# EAGLE design Debug-Edge_SWD-to-J-Link-Edu-Mini-adapter-with-USB-power (EAGLE 9.4.2)
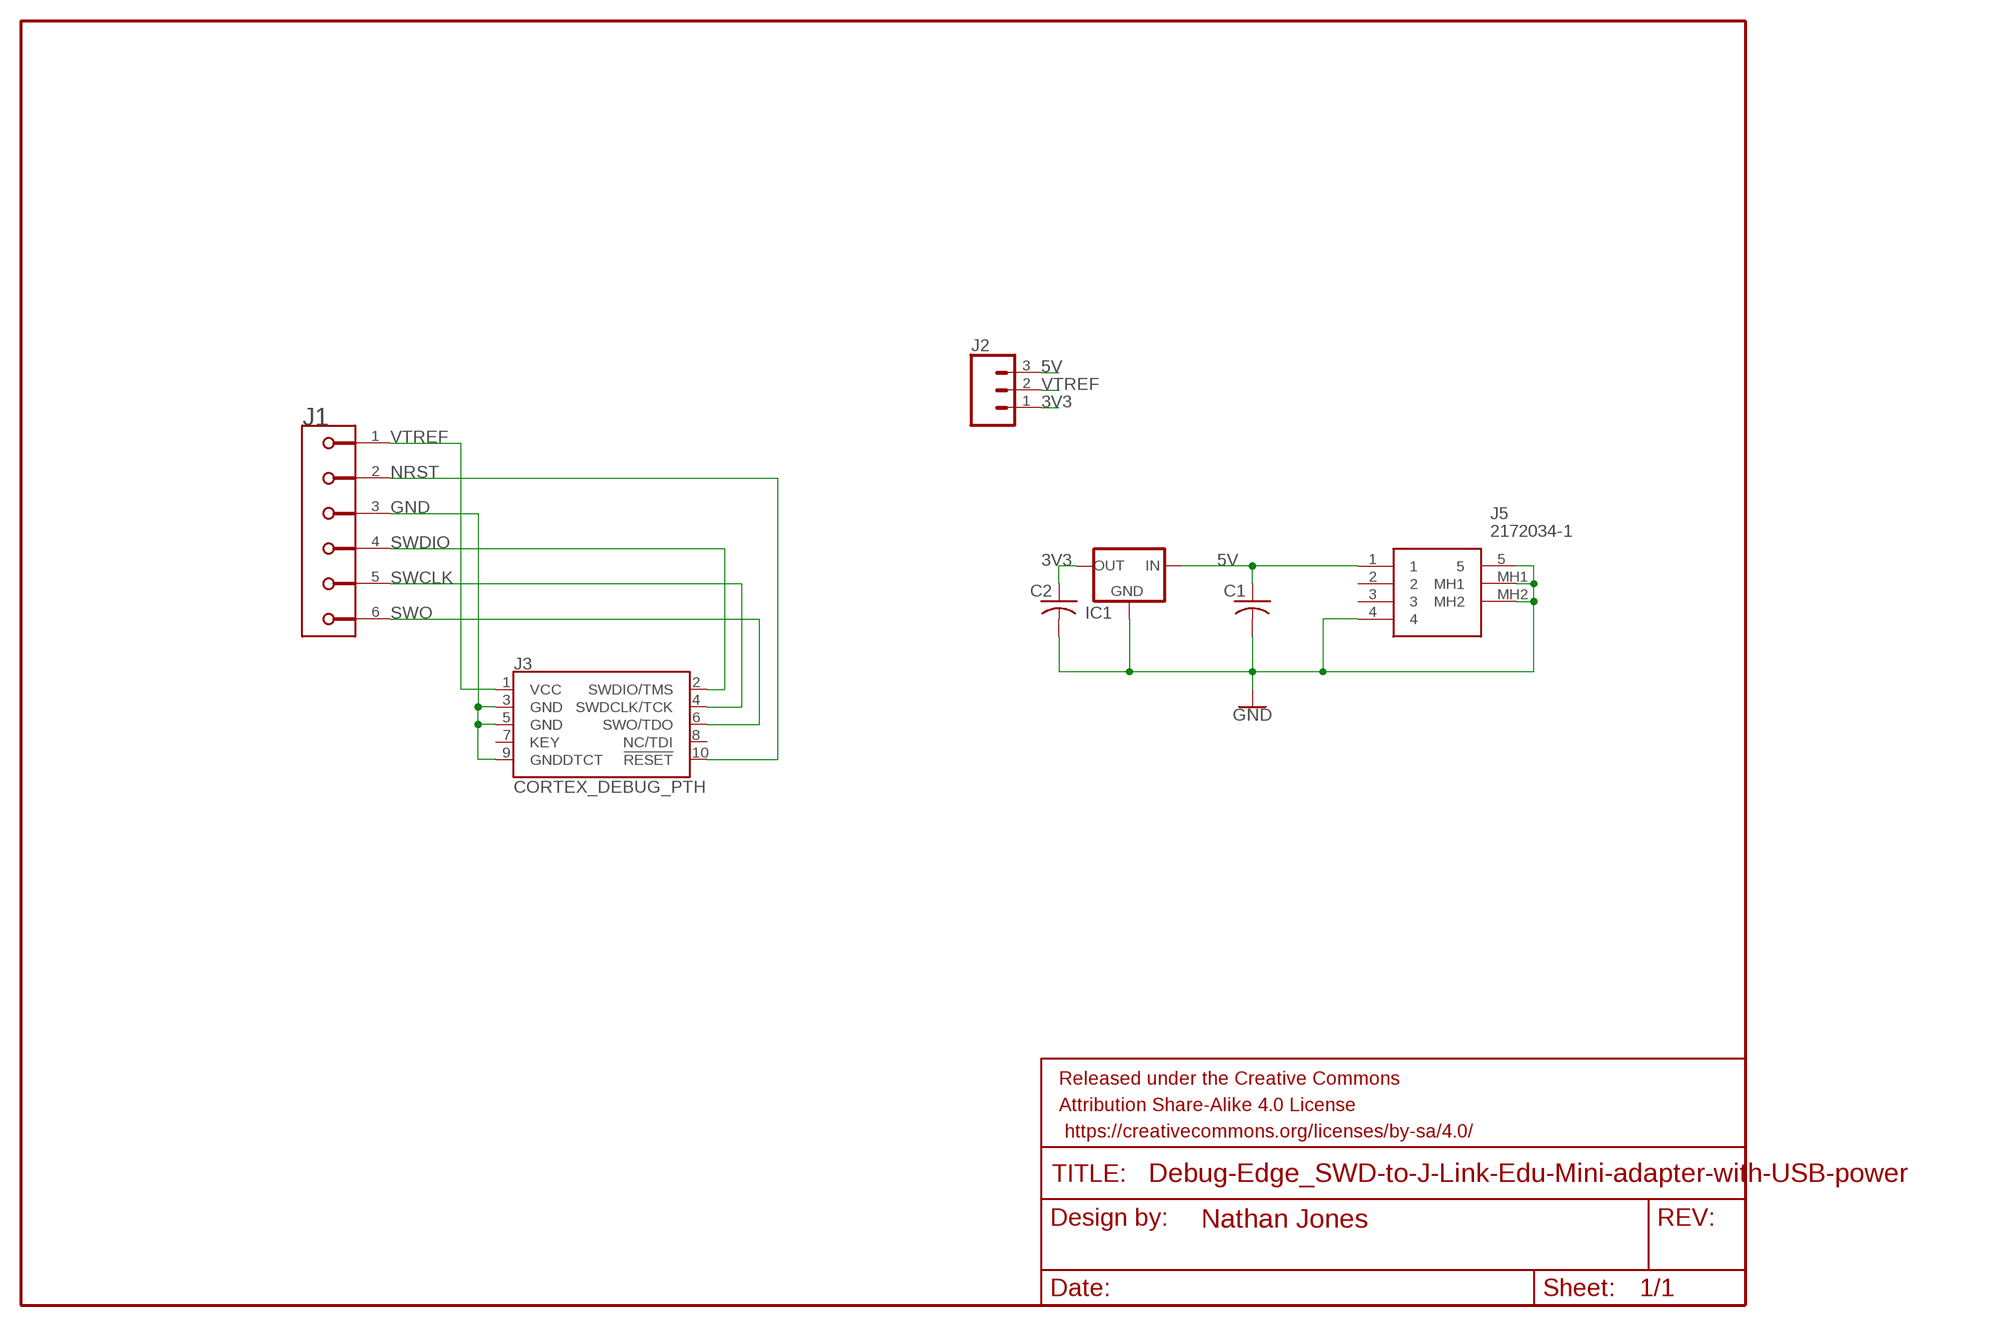
[diagram p0: schematic, sheet 1]

## Parts
C1  C-US025-024X044  [C025-024X044]
C2  C-US025-024X044  [C025-024X044]
FRAME1  FRAME-LETTERNO_PACKAGE  [DUMMY]
IC1  MCP1700INLINE  [TO92-INLINE]
J1  AVX_6-PIN_009159006061916  [AVX_6-PIN_009159006061916_0]
J2  CONN_031X03_NO_SILK  [1X03_NO_SILK]
J3  CORTEX_DEBUG_PTH  [2X5-PTH-1.27MM]
J5  2172034-1  [21720341]

## Nets
3V3: C2.1 IC1.3(OUT) J2.1
5V: C1.1 IC1.2(IN) J2.3 J5.1
GND: C1.2 C2.2 IC1.1(GND) J1.3 J3.3(GND) J3.5(GND) J3.9(GNDDTCT) J5.4 J5.5 J5.MH1 J5.MH2
NRST: J1.2 J3.10(!RESET)
SWCLK: J1.5 J3.4(SWDCLK/TCK)
SWDIO: J1.4 J3.2(SWDIO/TMS)
SWO: J1.6 J3.6(SWO/TDO)
VTREF: J1.1 J2.2 J3.1(VCC)
Unconnected: J3.7(KEY) J3.8(NC/TDI) J5.2 J5.3

## Library data of the parts
C1 C2 = adafruit:C-US: CAPACITOR, American symbol
FRAME1 = SparkFun-Aesthetics:FRAME-LETTER: Schematic Frame - Letter Standard 8.5x11 US Letter frame; DESIGNER: Nathan Jones; VERSION: v01
IC1 = adafruit:MCP1700: VOLTAGE REGULATOR
J1 = Debug-Edge_AVX-connectors:AVX_6-PIN_009159006061916
J2 = SparkFun-Connectors:CONN_03: Multi connection point. Often used as Generic Header-pin footprint for 0.1 inch spaced/style header connections On any of the 0.1 inch spaced packages, you can populate with these: Break Away Headers - Straight <https://www.sparkfun.com/products/116> (PRT-00116) Break Away Male Headers - Right Angle <https://www.sparkfun.com/products/553> (PRT-00553) Female Headers <https://www.sparkfun.com/products/115> (PRT-00115) Break Away Headers - Machine Pin <https://www.sparkfun.com/products/117> (PRT-00117) Break Away Female Headers - Swiss Machine Pin <https://www.sparkfun.com/products/743> (PRT-00743) Stackable Header - 3 Pin (Female, 0.1") <https://www.sparkfun.com/products/13875> (PRT-13875) For SCREWTERMINALS and SPRING TERMINALS visit here: Screw Terimnals on SparkFun.com <https://www.sparkfun.com/search/results?term=Screw+Terminals> (5mm/3.5mm/2.54mm spacing) This device is also useful as a general connection point to wire up your design to another part of your project. Our various solder wires solder well into these plated through hole pads. Hook-Up Wire - Assortment (Stranded, 22 AWG) <https://www.sparkfun.com/products/11375> (PRT-11375) Hook-Up Wire - Assortment (Solid Core, 22 AWG) <https://www.sparkfun.com/products/11367> (PRT-11367) View the entire wire category on our website here <https://www.sparkfun.com/categories/141> Special notes: Molex polarized connector foot print use with SKU : PRT-08232 with associated crimp pins and housings.
J3 = SparkFun-Connectors:CORTEX_DEBUG: Cortex Debug Connector - 10 pin Supports JTAG debug, Serial Wire debug, and Serial Wire Viewer. PTH and SMD connector options available. General Connector Information <http://infocenter.arm.com/help/topic/com.arm.doc.faqs/attached/13634/cortex_debug_connectors.pdf> Products: PTH Connector <http://www.digikey.com/product-detail/en/cnc-tech/3220-10-0100-00/1175-1627-ND/3883661> -via Digi-Key SparkFun PSoc <https://www.sparkfun.com/products/13229> SparkFun T <https://www.sparkfun.com/products/13810>
J5 = 2172034-1:2172034-1: CONN RCPT USB MINI B 2.0 PCB R/A Source: Datasheet <https://www.te.com/commerce/DocumentDelivery/DDEController?Action=srchrtrv&DocNm=2172034&DocType=Customer Drawing&DocLang=English>; ARROW_PART_NUMBER: 2172034-1; ARROW_PRICE-STOCK: https://www.arrow.com/en/products/2172034-1/te-connectivity; DESCRIPTION: CONN RCPT USB MINI B 2.0 PCB R/A; HEIGHT: 3.9mm; MANUFACTURER_NAME: TE Connectivity; MANUFACTURER_PART_NUMBER: 2172034-1; MOUSER_PART_NUMBER: 571-2172034-1; MOUSER_PRICE-STOCK: https://www.mouser.co.uk/ProductDetail/TE-Connectivity/2172034-1/?qs=Ev%252BS503VEAHBC%252BPBdsvCGg%3D%3D

## Board
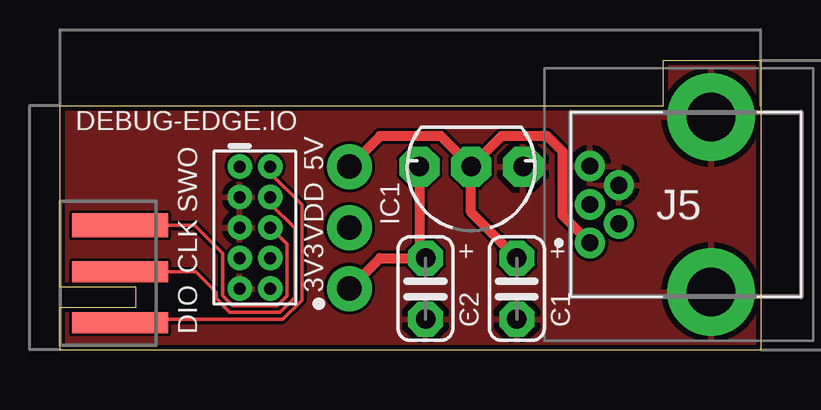
[diagram p1: board, top side]
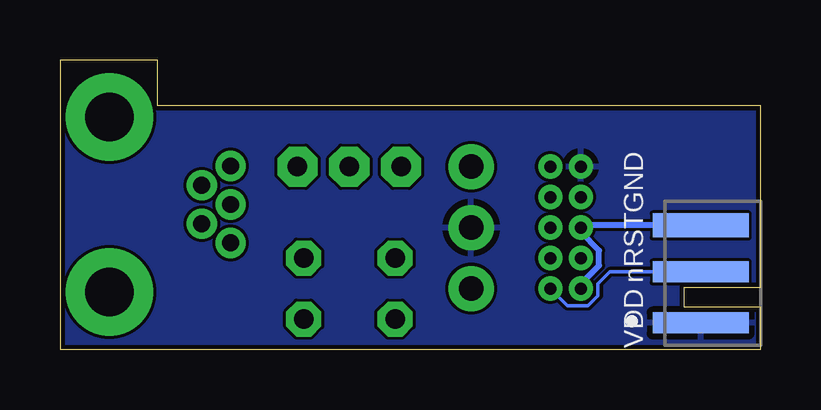
[diagram p2: board, bottom side, seen from below]

Size 29.21 x 12.06 mm. Coordinates in mm from the lower left corner, seen from the top.
Outline: 0,0 29.21,0 29.21,12.06 25.15,12.06 25.15,10.16 0,10.16 0,2.59 3.17,2.59 3.17,1.75 0,1.75 0,0
Copper layers (1*16): Top 0.035mm / dielectric 1.6mm / Bottom 0.035mm
Design rules "jlcpcb-2layers": minimum track width 5mil, minimum drill 0.3mm, track to track 5mil, track to pad 5mil, pad to pad 5mil, via to via 5mil, smd to smd 5mil, copper to edge 0.2mm, drill to drill 6mil, minimum pad ring 10mil, minimum via ring 3mil, stop-mask expansion 4mil, vias tented up to drill 0mil, thermal gap 10mil

### Footprints (pad centres in the part's own frame; a part is rotated, then mirrored left to right if it is on the bottom)
C025-024X044 = drill 0.813 pad 1.422 octagon: 1 -1.27,0; 2 1.27,0
TO92-INLINE = drill 0.813 pad 1.676 octagon: 1 -2.159,0; 2 0,0; 3 2.159,0
AVX_6-PIN_009159006061916_0 = smd 0.873 x 4: 1 -2.063,2.5; 2 0.064,2.5 | smd 1 x 4: 3 2,2.5 | smd 0.873 x 4 bottom: 4 -2.063,2.5; 5 0.064,2.5 | smd 1 x 4 bottom: 6 2,2.5
1X03_NO_SILK = drill 1.016 pad 1.88: 1 0,0; 2 2.54,0; 3 5.08,0
2X5-PTH-1.27MM = drill 0.508 pad 1: 1 -2.54,-0.635; 2 -2.54,0.635; 3 -1.27,-0.635; 4 -1.27,0.635; 5 0,-0.635; 6 0,0.635; 7 1.27,-0.635; 8 1.27,0.635; 9 2.54,-0.635; 10 2.54,0.635
21720341 = drill 0.7 pad 1.2: 1 0,0; 2 1.2,0.8; 3 0,1.6; 4 1.2,2.4; 5 0,3.2 | drill 2.025 pad 3.037: MH1 5.05,5.25; MH2 5.05,-2.05

### Placement (x,y rotation side)
C1  19.05,2.54 270 top
C2  15.24,2.54 270 top
FRAME1  0,-1.27 0 top
IC1  17.14,7.62 180 top
J1  0,3.17 90 bottom
J2  12.06,2.54 90 top
J3  8.13,5.08 270 top
J5  22.1,4.45 0 top

### Tracks (layer width: path | path; a pad name or v marks a point on that pad's centre or on a via)
3V3
  Top 0.406: IC1.3 14.99,4.06 C2.1 13.34,3.81 J2.1
5V
  Top 0.406: IC1.2 18.41,8.89 20.32,8.89 20.95,8.26 20.95,5.59 J5.1 | C1.1 17.14,5.71 IC1.2 | IC1.2 15.88,8.89 13.34,8.89 J2.3
GND
  Bottom 0.254: J1.3 7.4,5.17 J3.5 7.49,4.89 6.73,4.13 6.73,3.49 7.49,2.73 J3.9
  pour Top: 0,0 0,10.16 24.77,10.16 24.77,12.06 29.21,12.06 29.21,0
NRST
  Bottom 0.152: J1.2 6.29,3.24 6.78,2.74 6.78,2.25 7.2,1.83 8.05,1.83 J3.10
SWCLK
  Top 0.152: J1.5 5.65,3.24 6.5,2.39 6.5,2.13 7.08,1.55 9.17,1.55 9.8,2.18 9.8,5.04 8.76,6.09 J3.4
SWDIO
  Top 0.152: J1.4 2.66,1.27 9.29,1.27 10.08,2.06 10.08,6.04 8.76,7.36 J3.2
SWO
  Top 0.152: J1.6 5.62,5.17 6.78,4.01 6.78,2.25 7.2,1.83 9.06,1.83 9.47,2.25 9.47,4.39 8.79,5.08 J3.6
VTREF
  pour Bottom: 0,0 0,10.16 24.77,10.16 24.77,12.06 29.21,12.06 29.21,0

### Text on the board
tNames: DEBUG-EDGE.IO | 5V | VDD | SWO | 3V3 | - + | - + | CLK | DIO
bNames: GND | nRST | VDD